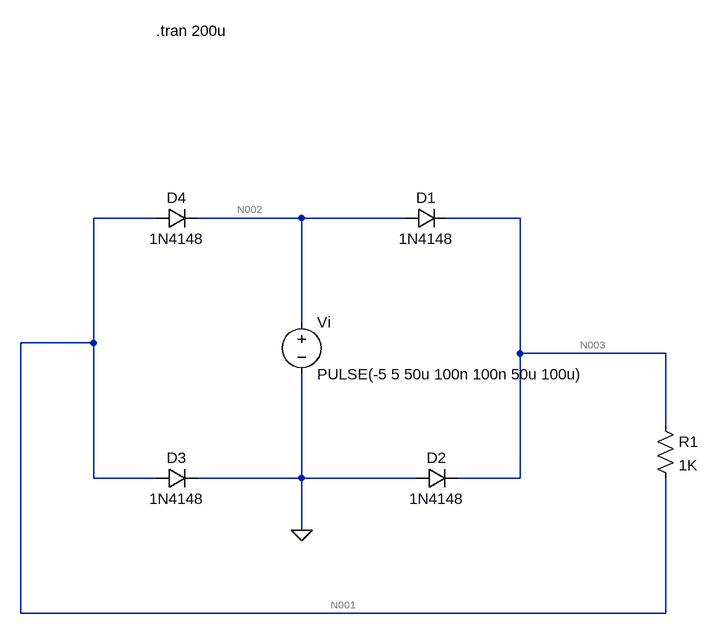
[diagram p0: schematic 122.asc]
122.asc, the LTspice schematic file:
Version 4.1
SHEET 1 880 680
WIRE -240 -224 -336 -224
WIRE -16 -224 -176 -224
WIRE 144 -224 -16 -224
WIRE 320 -224 208 -224
WIRE -16 -64 -16 -224
WIRE -336 -32 -336 -224
WIRE -336 -32 -448 -32
WIRE 320 -16 320 -224
WIRE 544 -16 320 -16
WIRE 544 96 544 -16
WIRE -336 176 -336 -32
WIRE -240 176 -336 176
WIRE -16 176 -16 16
WIRE -16 176 -176 176
WIRE 160 176 -16 176
WIRE 320 176 320 -16
WIRE 320 176 224 176
WIRE -16 256 -16 176
WIRE -448 384 -448 -32
WIRE 544 384 544 176
WIRE 544 384 -448 384
FLAG -16 256 0
SYMBOL voltage -16 -80 R0
WINDOW 123 0 0 Left 0
WINDOW 39 0 0 Left 0
SYMATTR InstName Vi
SYMATTR Value PULSE(-5 5 50u 100n 100n 50u 100u)
SYMBOL diode -240 -208 R270
WINDOW 0 32 32 VTop 2
WINDOW 3 0 32 VBottom 2
SYMATTR InstName D4
SYMATTR Value 1N4148
SYMBOL diode 144 -208 R270
WINDOW 0 32 32 VTop 2
WINDOW 3 0 32 VBottom 2
SYMATTR InstName D1
SYMATTR Value 1N4148
SYMBOL diode -240 192 R270
WINDOW 0 32 32 VTop 2
WINDOW 3 0 32 VBottom 2
SYMATTR InstName D3
SYMATTR Value 1N4148
SYMBOL diode 160 192 R270
WINDOW 0 32 32 VTop 2
WINDOW 3 0 32 VBottom 2
SYMATTR InstName D2
SYMATTR Value 1N4148
SYMBOL res 528 80 R0
SYMATTR InstName R1
SYMATTR Value 1K
TEXT -240 -512 Left 2 !.tran 200u

The netlist it stands for:
* 122.asc
Vi N002 0 PULSE(-5 5 50u 100n 100n 50u 100u)
D4 N001 N002 1N4148
D1 N002 N003 1N4148
D3 N001 0 1N4148
D2 0 N003 1N4148
R1 N003 N001 1K
.model D D
.lib standard.dio
.tran 200u
.backanno
.end

* Results of the author's LTspice run, read from the files saved beside the schematic
* Operating Point, zero values left out:
*   V(n001) = -4.354 V
*   V(n002) = -5 V
*   V(n003) = -645.7 mV
*   I(Vi) = 3.709 mA
*   I(D1) = -2.524 nA
*   I(D2) = 3.709 mA
*   I(R1) = 3.709 mA
*   I(D4) = 3.709 mA
*   I(D3) = -2.524 nA
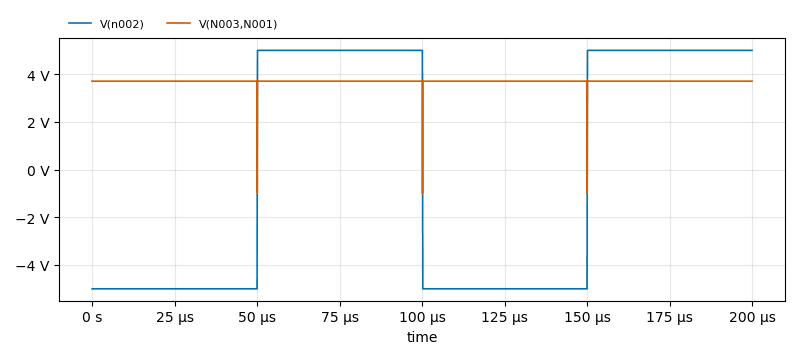
[diagram p1: Transient Analysis of 122.asc, plotted from the saved traces]
* Transient Analysis, 1 run:
*   V(n002): min -5 V, max 5 V, average 2.5 mV, rms 4.998 V, last 5 V
*   V(N003,N001): min -1.002 V, max 3.753 V, average 3.705 V, rms 3.707 V, last 3.709 V